# Altium schematic sheet linear_power_supply.SchDoc
size A
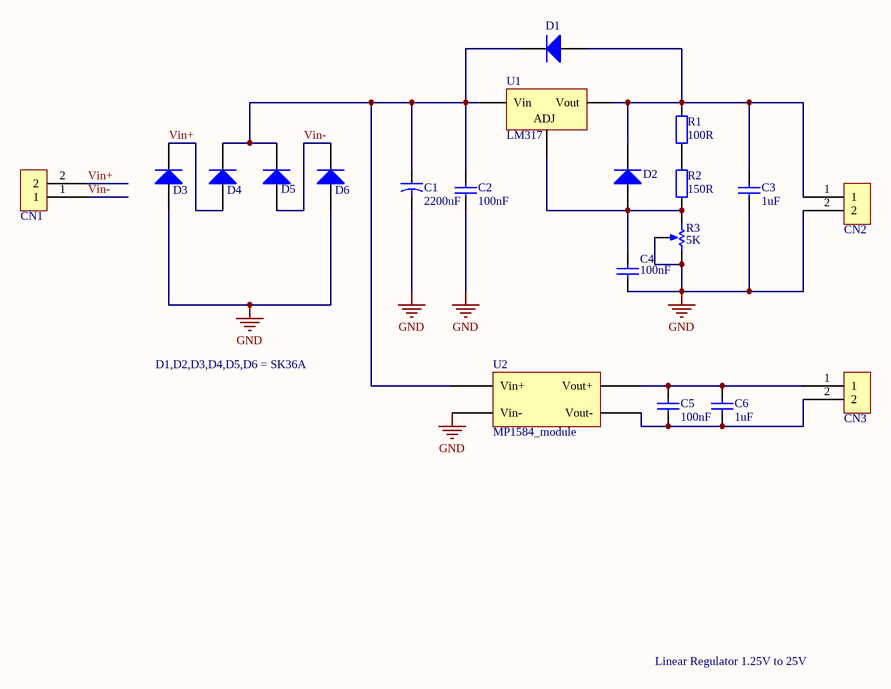
[diagram p0: linear_power_supply.SchDoc]

## Parts
C1  value 2200uF  [CAPR5-4X5]  (hidden comment: Cap2)
C2  value 100nF  [0805 C]  (hidden comment: Cap-cer-100nF-50V-0805)
C3  value 1uF  [0805 C]  (hidden comment: Cap-cer-1uF-16V-0805)
C4  value 100nF  [0805 C]  (hidden comment: Cap-cer-100nF-50V-0805)
C5  value 100nF  [0805 C]  (hidden comment: Cap-cer-100nF-50V-0805)
C6  value 1uF  [0805 C]  (hidden comment: Cap-cer-1uF-16V-0805)
CN1  Pin Head 2  [KRM mini]  (value not drawn)
CN2  Pin Head 2  [KRM mini]  (value not drawn)
CN3  Pin Head 2  [KRM mini]  (value not drawn)
D1  Diode 1N4007  [DO-214AC]  (value not drawn)
D2  Diode 1N4007  [DO-214AC]  (value not drawn)
D3  Diode 1N4007  [DO-214AC]  (value not drawn)
D4  Diode 1N4007  [DO-214AC]  (value not drawn)
D5  Diode 1N4007  [DO-214AC]  (value not drawn)
D6  Diode 1N4007  [DO-214AC]  (value not drawn)
R1  value 100R  [0805 R]  (hidden comment: Res-100R-0805-1%-1/8W)
R2  value 150R  [0805 R]  (hidden comment: Res-150R-0805-1%-1/8W)
R3  value 5K  [VR5]  (hidden comment: RPot)
U1  LM317  [DPAK]
U2  MP1584_module  [MP1584_module]

## Nets
GND: C1.2 C2.1 C3.1 C4.1 CN2.2 D3.1(A) D6.1(A) R3.2(BOT) R3.3(TAP) U2.2(Vin-)
Vin+: CN1.2 D3.2(K) D4.1(A)
Vin-: CN1.1 D5.1(A) D6.2(K)
NetC1_1: C1.1 C2.2 D1.2(K) D4.2(K) D5.2(K) U1.2(Vin) U2.1(Vin+)
NetC3_2: C3.2 CN2.1 D1.1(A) D2.2(K) R1.2 U1.3(Vout)
NetC4_2: C4.2 D2.1(A) R2.1 R3.1(TOP) U1.1(ADJ)
NetC5_1: C5.1 C6.1 CN3.2 U2.3(Vout-)
NetC5_2: C5.2 C6.2 CN3.1 U2.4(Vout+)
NetR1_1: R1.1 R2.2

## Notes on the sheet
- D1,D2,D3,D4,D5,D6 = SK36A
- Linear Regulator 1.25V to 25V

## Library data of the parts
C1 = Cap2: Capacitor; Published: 23-Sep-2002; PackageReference: CAPR5-4X5; Publisher: Altium Limited; PackageDescription: Capacitor; 2 Leads
C2 C4 C5 = Cap-cer-100nF-50V-0805: Capacitor, ceramic, 100nF, 50V, 0805; Part Number: RK-cer-100nF-50V-0805
C3 C6 = Cap-cer-1uF-16V-0805: Capacitor, ceramic, 1uF, 16V, 0805; Part Number: RK-cer-1uF-16V-0805
D1-D6 = Diode 1N4007: 1 Amp General Purpose Rectifier; Published: 8-Jun-2000; LatestRevisionDate: 17-Jul-2002; LatestRevisionNote: Re-released for DXP Platform.; DatasheetVersion: 1998; PackageVersion: Aug-1999; PackageReference: DO-41; Publisher: Altium Limited; PackageDescription: Diode, Axial; Body 5.2 x 2.7 mm (LxDia. max), Lead Dia. 0.86 mm (max); Code_JEDEC: DO-204-AL; ComponentLink1Description: Manufacturer Link; ComponentLink1URL: http://www.fairchildsemi.com/; ComponentLink2Description: Datasheet; ComponentLink2URL: http://www.fairchildsemi.com/ds/1N%2F1N4001.pdf
R1 = Res-100R-0805-1%-1/8W: Resistor, 100R, 0805, 1%, 1/8W; Part Number: RK-100R-0805-1%-1/8W
R2 = Res-150R-0805-1%-1/8W: Resistor, 150R, 0805, 1%, 1/8W; Part Number: RK-150R-0805-1%-1/8W
R3 = RPot: Potentiometer; Sim Note: Enter the Resistance value and the set point into parameter fields.; Set Position: 0.5; Published: 8-Jun-2000; LatestRevisionDate: 17-Jul-2002; LatestRevisionNote: Re-released for DXP Platform.; PackageReference: VR5; Publisher: Altium Limited; PackageDescription: Variable Resistor, Thru-Hole; 3 Leads
U1 = LM317: Linear Voltage Regulator; Published: 24-Mar-1999; LatestRevisionDate: 29-May-2009; LatestRevisionNote: IPC-7351 Footprint Added.; PackageReference: D2PAK; Publisher: Altium Limited; PackageDescription: 3-Pin Transistor Outline Package 2.54 mm Pitch, 15.1 mm Lead Span
U2 = MP1584_module: Buck regulator module